# Altium schematic sheet DAPMainSheet.SchDoc
size A; SheetNumber: 1; SheetTotal: 1
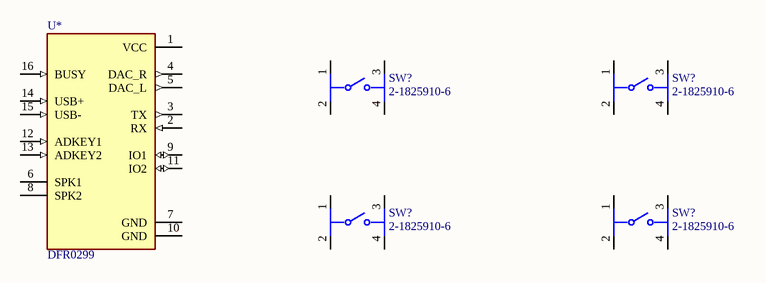
[diagram p0: DAPMainSheet.SchDoc]

## Parts
(Parts that share a designator on the sheet are numbered #1, #2 ... from top to bottom, then left to right.)
SW?#1  2-1825910-6  [FP-2-1825910-6-MFG]
SW?#2  2-1825910-6  [FP-2-1825910-6-MFG]
SW?#3  2-1825910-6  [FP-2-1825910-6-MFG]
SW?#4  2-1825910-6  [FP-2-1825910-6-MFG]
U*  DFR0299  [DFR0299]

## Nets

Not connected (* = marked no-connect by the designer): SW?#1 1 2 3 4; SW?#2 1 2 3 4; SW?#3 1 2 3 4; SW?#4 1 2 3 4; U* 1(VCC) 2(RX) 3(TX) 4(DAC_R) 5(DAC_L) 6(SPK1) 7(GND) 8(SPK2) 9(IO1) 10(GND) 11(IO2) 12(ADKEY1) 13(ADKEY2) 14(USB+) 15(USB-) 16(BUSY)

## Library data of the parts
SW?#1-SW?#4 = CMP-03407-000025-1: SWITCH TACTILE SPST-NO 0.05A 24V; Max Current Rating: 50mA; Actuator Type: Standard; Illumination Type: Non-Illuminated; Actuator Material: Nylon; Throw Configuration: SPST; Actuator Length: 0.37inch; Operating Force: 100gf; Switch Function: Off-Mom; Mechanical Life: 100000Cycles; Actuator Color: Brown; Switch Travel: 0.25mm; Packaging: Loose Piece; Series: FSMJ; RoHS Compliant: Yes; Mount: Through Hole; Lead Free: Lead Free; Length: 5.99mm; Voltage Rating (DC): 24V; Type: Switch; Contact Current Rating: 50mA; Contact Material: Copper Alloy; Max Operating Temperature: 85°C; Min Operating Temperature: -35°C; Termination: PC Pin; ELV: Compliant; Orientation: Straight; Contact Plating: Silver
U* = DFR0299: DFRobot DFR0299 DFPlayer - A Mini MP3 Player For Arduino; Supplier: DigiKey; Supplier Part Number: 1738-1041-ND; Manufacturer: DFRobot; Manufacturer Part Number: DFR0299; Category: Uncategorized; Stock: 972; Pricing: 1=5.9 (USD); RoHS: Non-Compliant; Schedule B: 8542900000, 8542900000|8542900000|8542900000|8542900000|8542900000; Supplier 1: DigiKey; Supplier Part Number 1: 1738-1041-ND